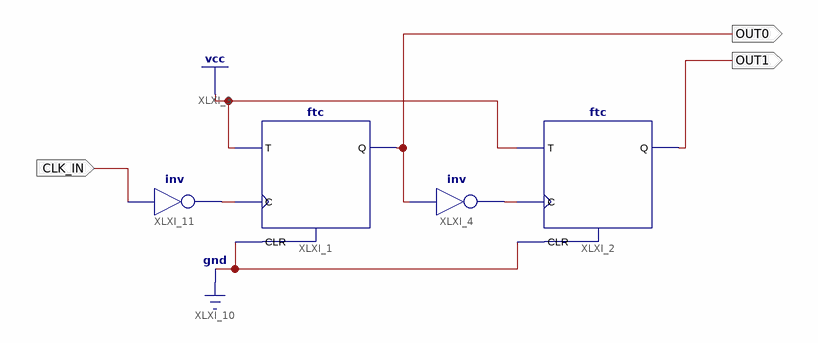
[diagram p0: schematic sheet 1]
// Xilinx ISE schematic twoBitCounter.sch (spartan6) as structural Verilog: 4 symbols, 3 ports
module twoBitCounter (
  input  CLK_IN,
  output OUT0,
  output OUT1
);

  wire XLXN_4, XLXN_14;

  ftc XLXI_1 (.C(XLXN_14), .CLR(1'b0), .T(1'b1), .Q(OUT0));
  ftc XLXI_2 (.C(XLXN_4), .CLR(1'b0), .T(1'b1), .Q(OUT1));
  not XLXI_4 (XLXN_4, OUT0);
  not XLXI_11 (XLXN_14, CLK_IN);
endmodule
